# EAGLE design RH024.1 (EAGLE 7.1.0)
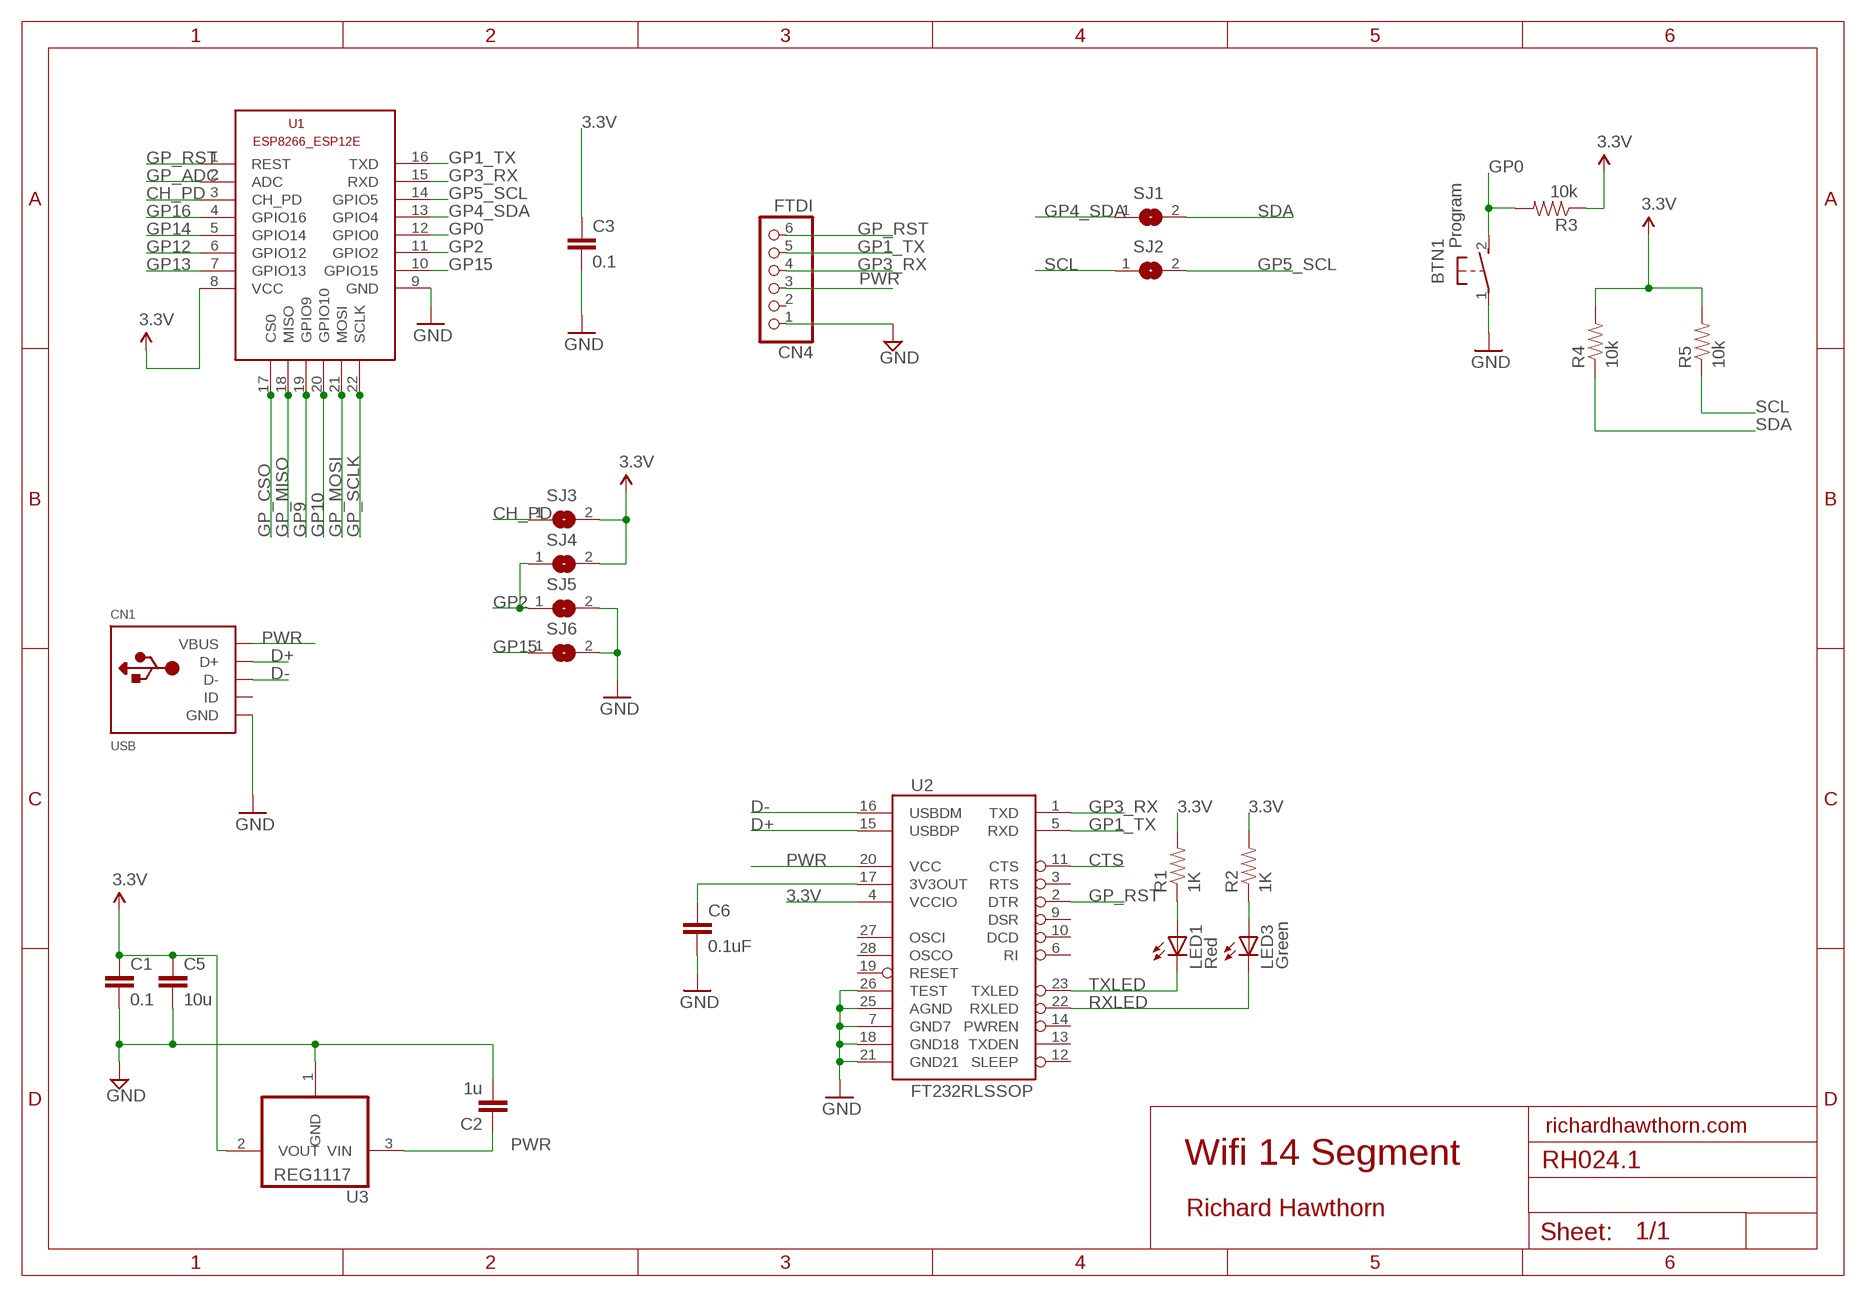
[diagram p0: schematic, sheet 1, part 1 of 2]
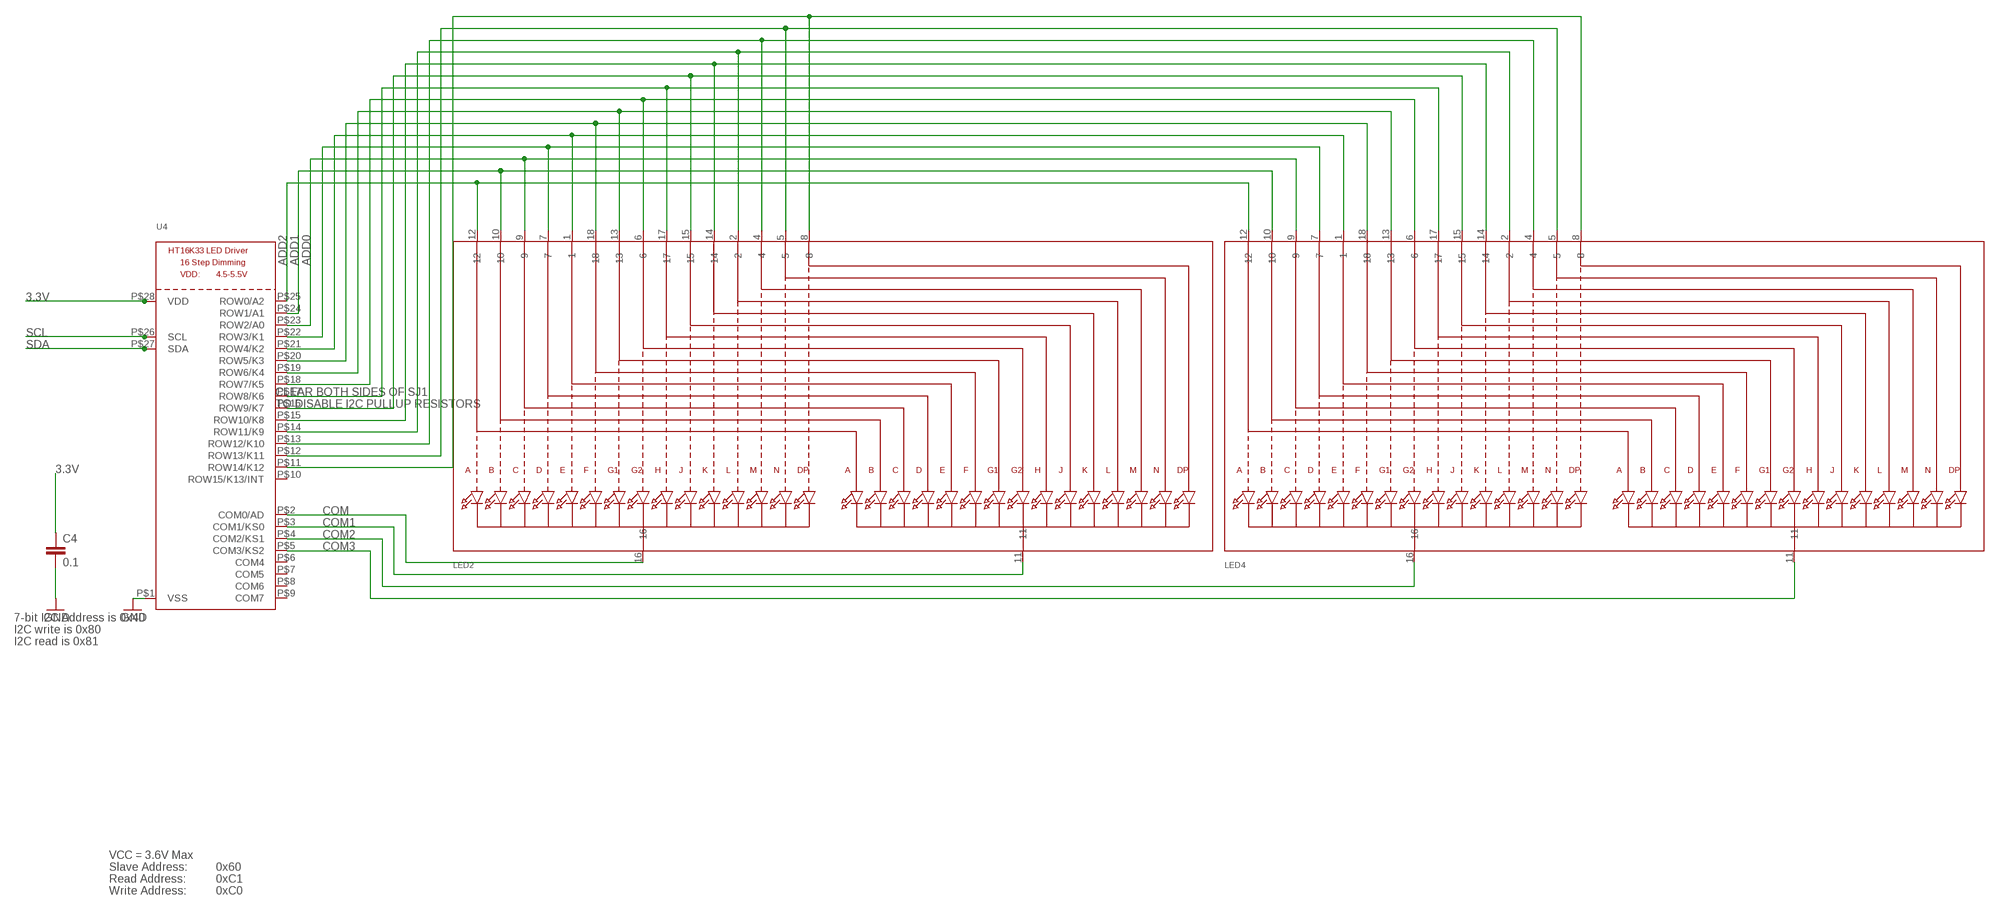
[diagram p1: schematic, sheet 1, part 2 of 2]

## Parts
BTN1  Program  DTS-3  [DTS-3]
C1  0.1  CAP0603-CAP  [0603-CAP]
C2  1u  CAP0603-CAP  [0603-CAP]
C3  0.1  CAP0603-CAP  [0603-CAP]
C4  0.1  CAP0603-CAP  [0603-CAP]
C5  10u  CAP0805-CAP  [0805-CAP]
C6  0.1uF  CAP0402-CAP  [0402-CAP]
CN1  USB  USBMINIB  [USB-MINIB]
CN4  FTDI  PINHD-1X6  [1X06]
LED1  Red  LED0603  [LED-0603]
LED2  DISP_SEGMENT_STARBURST_DUAL_COMMONCATHODE  [SEGMENT_STARTBUST_DUAL_KWA-541CBB]
LED3  Green  LED0603  [LED-0603]
LED4  DISP_SEGMENT_STARBURST_DUAL_COMMONCATHODE  [SEGMENT_STARTBUST_DUAL_KWA-541CBB]
R1  1K  RESISTOR0402-RES  [0402-RES]
R2  1K  RESISTOR0402-RES  [0402-RES]
R3  10k  RESISTOR0805-RES  [0805]
R4  10k  RESISTOR0805-RES  [0805]
R5  10k  RESISTOR0805-RES  [0805]
SJ1  SJ  [SJ]
SJ2  SJ  [SJ]
SJ3  SJ  [SJ]
SJ4  SJ  [SJ]
SJ5  SJ  [SJ]
SJ6  SJ  [SJ]
U1  ESP8266-12EESP8266-ESP12E  [ESP8266-ESP12E]
U2  FT232RLSSOP  [SSOP28DB]
U3  REG1117  [SOT223]
U4  HT16K33_SOP28  [SOP28_300MIL]

## Nets
3.3V: C1.1 C3.1 C4.1 C5.1 R1.2 R2.2 R3.1 R4.2 R5.2 SJ3.2 SJ4.2 U1.8(VCC) U2.4(VCCIO) U3.2(VOUT) U4.P$28(VDD)
3.3VOUT: C6.1 U2.17(3V3OUT)
ADD0: LED2.9 LED4.9 U4.P$23(ROW2/A0)
ADD1: LED2.10 LED4.10 U4.P$24(ROW1/A1)
ADD2: LED2.12 LED4.12 U4.P$25(ROW0/A2)
CH_PD: SJ3.1 U1.3(CH_PD)
COM: LED2.16 U4.P$2(COM0/AD)
COM1: LED2.11 U4.P$3(COM1/KS0)
COM2: LED4.16 U4.P$4(COM2/KS1)
COM3: LED4.11 U4.P$5(COM3/KS2)
CTS: U2.11(CTS)
D+: CN1.D+ U2.15(USBDP)
D-: CN1.D- U2.16(USBDM)
GND [power]: BTN1.1 C1.2 C2.2 C3.2 C4.2 C5.2 C6.2 CN1.GND CN4.1 SJ5.2 SJ6.2 U1.9(GND) U2.7(GND7) U2.18(GND18) U2.21(GND21) U2.25(AGND) U2.26(TEST) U3.1(GND) U4.P$1(VSS)
GP0: BTN1.2 R3.2 U1.12(GPIO0)
GP1_TX: CN4.5 U1.16(TXD) U2.5(RXD)
GP2: SJ4.1 SJ5.1 U1.11(GPIO2)
GP3_RX: CN4.4 U1.15(RXD) U2.1(TXD)
GP4_SDA: SJ1.1 U1.13(GPIO4)
GP5_SCL: SJ2.2 U1.14(GPIO5)
GP9: U1.19(GPIO9)
GP10: U1.20(GPIO10)
GP12: U1.6(GPIO12)
GP13: U1.7(GPIO13)
GP14: U1.5(GPIO14)
GP15: SJ6.1 U1.10(GPIO15)
GP16: U1.4(GPIO16)
GP_ADC: U1.2(ADC)
GP_CSO: U1.17(CS0)
GP_MISO: U1.18(MISO)
GP_MOSI: U1.21(MOSI)
GP_RST: CN4.6 U1.1(REST) U2.2(DTR)
GP_SCLK: U1.22(SCLK)
N$2: LED1.A R1.1
N$3: LED3.A R2.1
N$22: LED2.7 LED4.7 U4.P$22(ROW3/K1)
N$23: LED2.1 LED4.1 U4.P$21(ROW4/K2)
N$24: LED2.18 LED4.18 U4.P$20(ROW5/K3)
N$25: LED2.13 LED4.13 U4.P$19(ROW6/K4)
N$26: LED2.6 LED4.6 U4.P$18(ROW7/K5)
N$29: LED2.17 LED4.17 U4.P$17(ROW8/K6)
N$30: LED2.15 LED4.15 U4.P$16(ROW9/K7)
N$31: LED2.14 LED4.14 U4.P$15(ROW10/K8)
N$32: LED2.2 LED4.2 U4.P$14(ROW11/K9)
N$33: LED2.4 LED4.4 U4.P$13(ROW12/K10)
N$34: LED2.5 LED4.5 U4.P$12(ROW13/K11)
N$35: LED2.8 LED4.8 U4.P$11(ROW14/K12)
PWR [power]: C2.1 CN1.VBUS CN4.3 U2.20(VCC) U3.3(VIN)
RXLED: LED3.C U2.22(RXLED)
SCL: R5.1 SJ2.1 U4.P$26(SCL)
SDA: R4.1 SJ1.2 U4.P$27(SDA)
TXLED: LED1.C U2.23(TXLED)
Unconnected: CN1.ID CN4.2 U2.3(RTS) U2.6(RI) U2.9(DSR) U2.10(DCD) U2.12(SLEEP) U2.13(TXDEN) U2.14(PWREN) U2.19(RESET) U2.27(OSCI) U2.28(OSCO) U4.P$6(COM4) U4.P$7(COM5) U4.P$8(COM6) U4.P$9(COM7) U4.P$10(ROW15/K13/INT)

## Notes on the sheet
- CLEAR BOTH SIDES OF SJ1
- TO DISABLE I2C PULLUP RESISTORS
- 7-bit I2C Address is 0x40
- I2C write is 0x80
- I2C read is 0x81
- richardhawthorn.com
- Wifi 14 Segment
- Richard Hawthorn
- VCC = 3.6V Max
- Slave Address: | 0x60
- Read Address: | 0xC1
- Write Address: | 0xC0

## Library data of the parts
BTN1 = switch-tact:DTS-3
C1-C5 = LowPowerLab:CAP: Capacitor Standard 0603 ceramic capacitor, and 0.1" leaded capacitor.
C6 = SparkFun:CAP: Capacitor Standard 0603 ceramic capacitor, and 0.1" leaded capacitor.
CN1 = LowPowerLab:USB: USB Connectors USBMINIB - Surface Mount Female Mini-B USB Connector 4UConnector: 06564 By microbuilder.eu Thru-hole RA Female Mini-B USB Connector 4UConnector: 18732 By ladyada.net
CN4 = pinhead:PINHD-1X6: PIN HEADER
LED1 LED3 = SparkFun:LED: LEDs Standard schematic elements and footprints for 5mm, 3mm, 1206, and 0603 sized LEDs. 5mm - Spark Fun Electronics SKU : COM-00529 (and others)
LED2 LED4 = microbuilder:DISP_SEGMENT_STARBURST_DUAL_COMMONCATHODE: 2 x Starburst Segment Displays - Common Cathode Luckylight KWA-541CBB
R1-R5 = SparkFun:RESISTOR: Resistor Basic schematic elements and footprints for 0603, 1206, and PTH resistors.
SJ1-SJ6 = jumper:SJ: SMD solder JUMPER
U1 = ESP8266-ESP12E:ESP8266-12E: ESP8266-12E with additional I/O and GPIO04/05 corrected The author cannot warrant that this library is free from error or will meet your specific requirements. Created by PuceBaboon.com. Komagane, Nagano, JAPAN
U2 = SparkFun:FT232RL: USB UART FT232RL 4th Generation USB UART (USB <-> Serial) Controller. Spark Fun Electronics SKU : COM-00650
U3 = burr-brown:REG1117: 800mA and 1A Low Dropout (LDO) Positive Regulator 1.8V, 2.5V, 2.85V, 3.3V, 5V, and Adj; MPN: REG1117; OC_FARNELL: 1097566; OC_NEWARK: 14P6981
U4 = microbuilder:HT16K33_SOP28

## Net classes
1 power: width 0.381 mm, clearance 0.254 mm

## Board
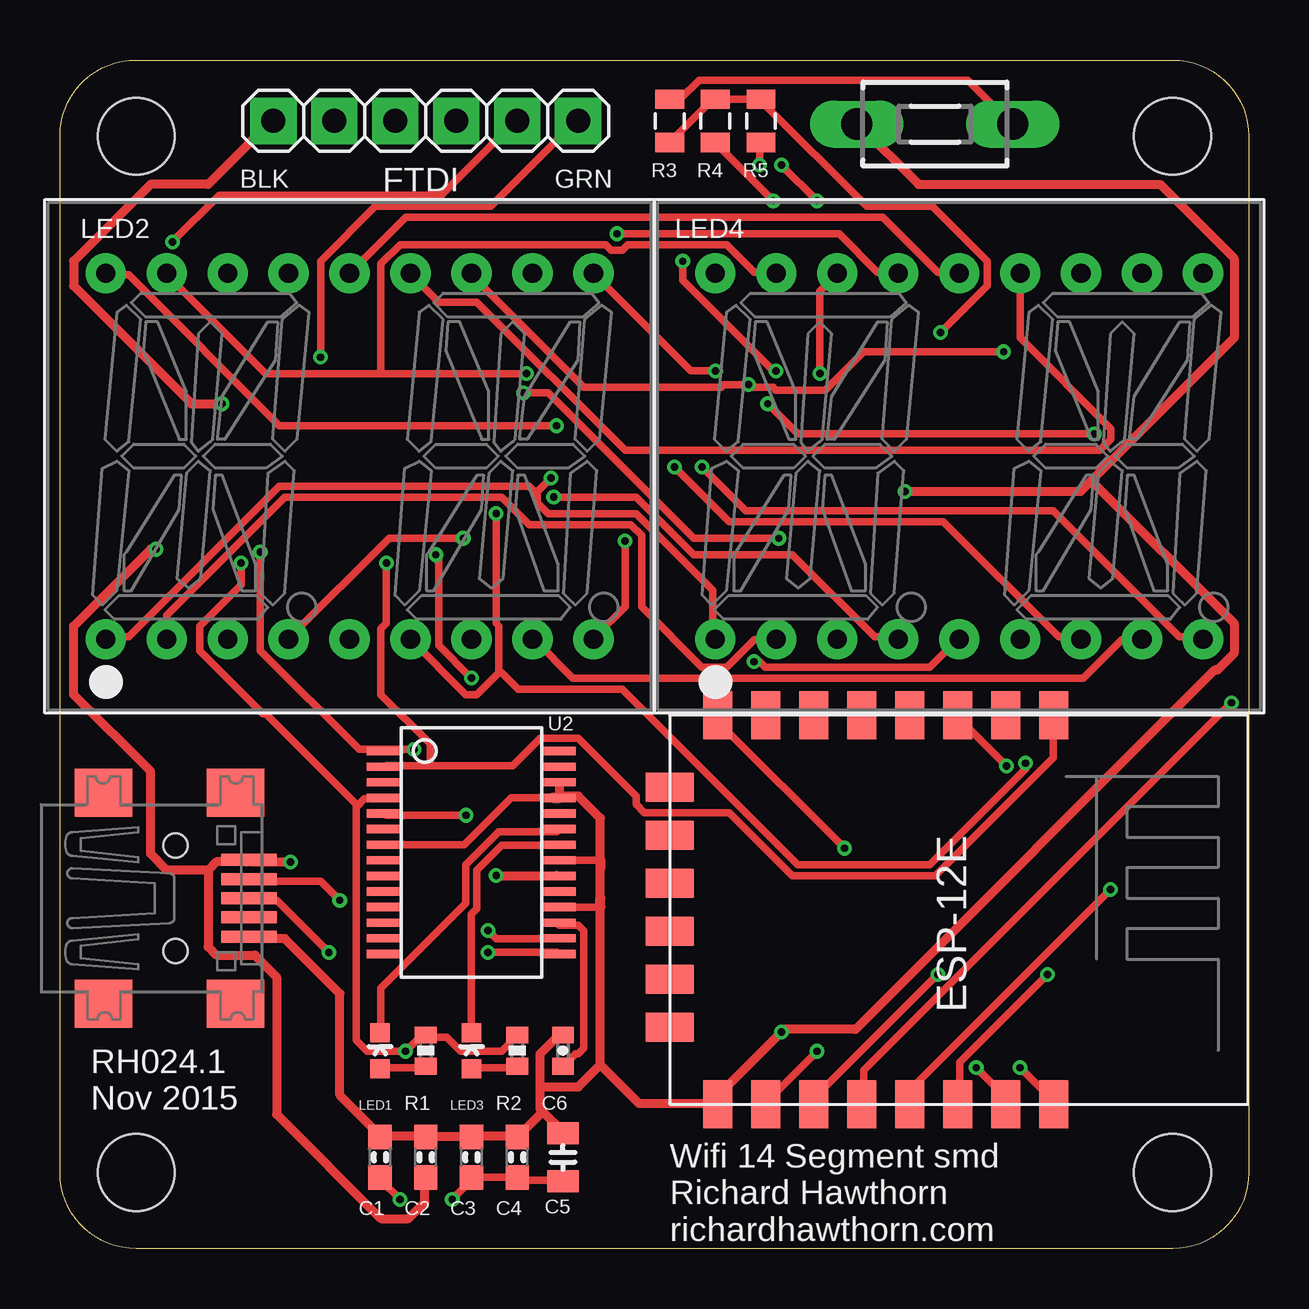
[diagram p2: board, top side]
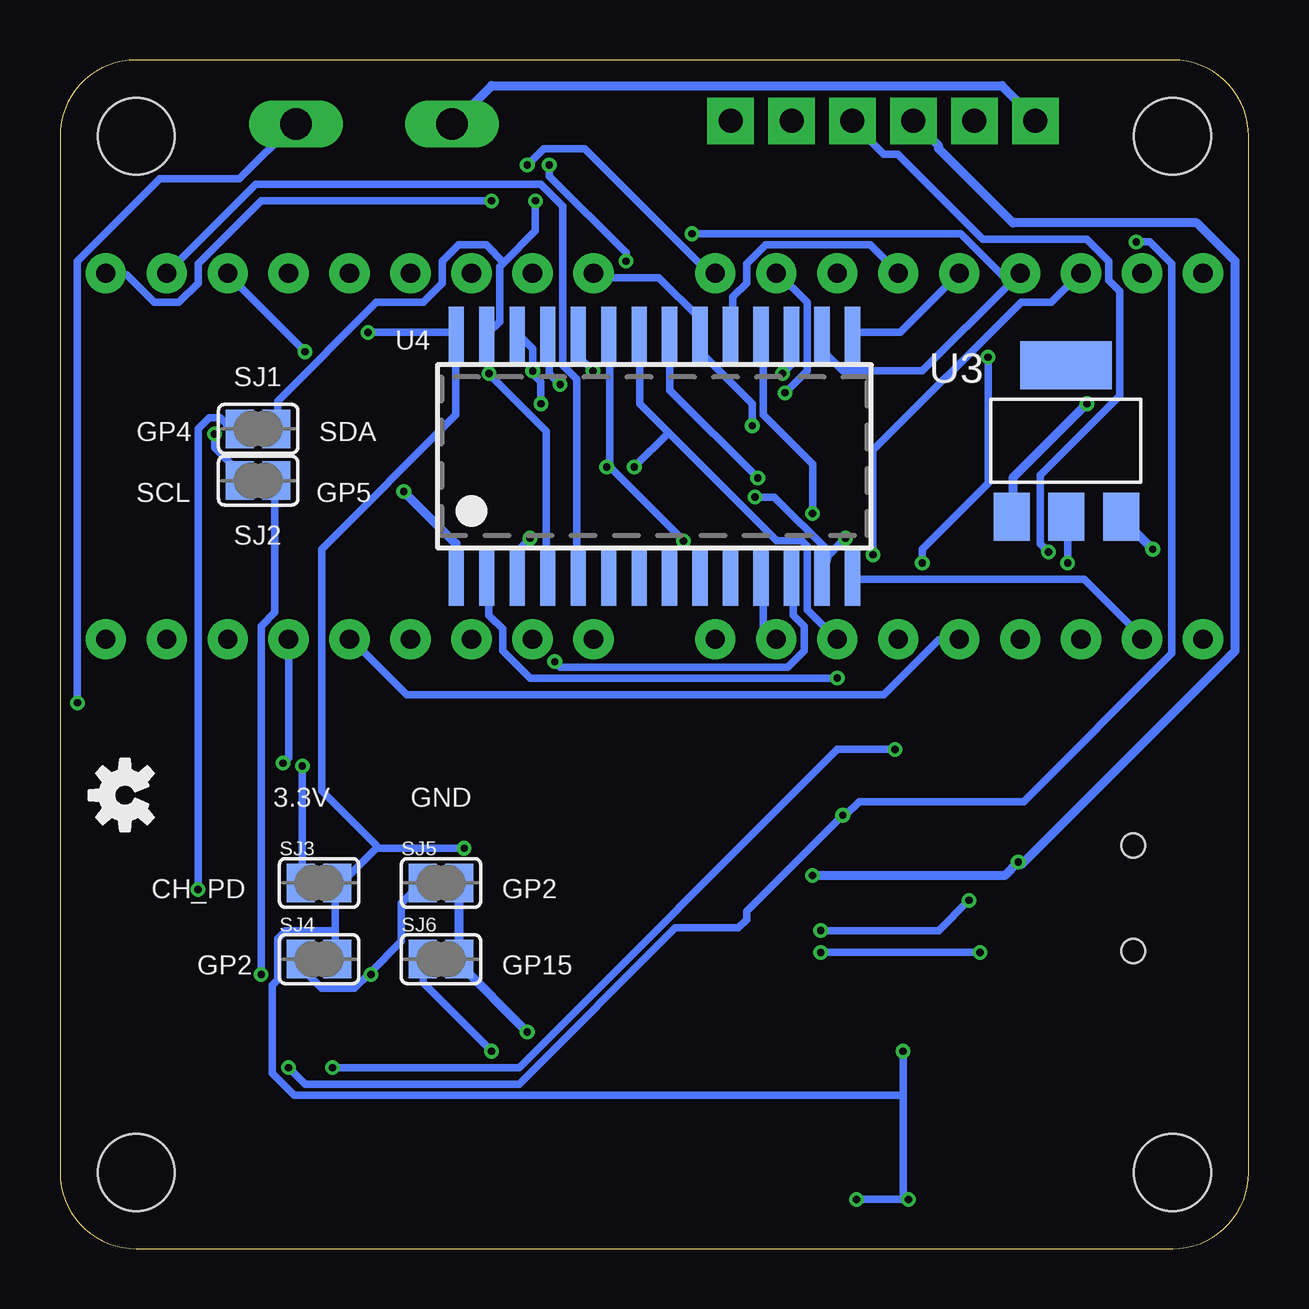
[diagram p3: board, bottom side, seen from below]

Size 49.53 x 49.53 mm. Coordinates in mm from the lower left corner, seen from the top.
Outline: 0,3.17 0,46.35 arc-90 3.17,49.53 46.35,49.53 arc-90 49.53,46.35 49.53,3.17 arc-90 46.35,0 3.17,0 arc-90 0,3.17
Copper layers (1*16): Top 0.035mm / dielectric 1.5mm / Bottom 0.035mm
Design rules "ITEADstudio_DRC *": minimum track width 12mil, minimum drill 12mil, track to track 6mil, track to pad 6mil, pad to pad 6mil, via to via 6mil, smd to smd 0mil, copper to edge 10mil, drill to drill 10mil, minimum pad ring 10mil, minimum via ring 6mil, stop-mask expansion 2mil, vias tented up to drill 100mil, thermal gap 15mil
Holes 3.2 mm at 3.17,3.17 46.35,3.17 3.17,46.35 46.35,46.35
tKeepout: area 0,0 to 5.7,5.7; area 43.8,0 to 49.5,5.7; area 43.8,43.8 to 49.5,49.5; area 0,43.8 to 5.7,49.5
bKeepout: area 0,43.8 to 5.7,49.5; area 43.8,43.8 to 49.5,49.5; area 43.8,0 to 49.5,5.7; area 0,0 to 5.7,5.7
tRestrict: area 24.3,8.9 to 29.1,12.8; area 5.8,16.9 to 6.9,18.5; area 5.2,9.7 to 6.7,10.4
bRestrict: area 27.4,17.7 to 29.2,18.7; area 21.1,13.8 to 22.9,14.9; area 21.6,12.6 to 22.1,13.2; area 20.7,12.6 to 21.2,13.2; area 20.2,12.8 to 20.7,13.5; area 20.1,13.4 to 20.6,14; area 26.5,18.9 to 27.1,19.5; area 26.5,17.9 to 27.1,18.5; area 27.5,19.1 to 28,19.8; area 27.9,18.8 to 29.1,19.6

### Footprints (pad centres in the part's own frame; a part is rotated, then mirrored left to right if it is on the bottom)
DTS-3 = drill 1.3 long: 1 -3.25,0; 2 3.25,0
0603-CAP = smd 1.016 x 0.965: 1 -0.85,0; 2 0.85,0
0805-CAP = smd 0.902 x 1.3: 1 -1,0; 2 1,0
0402-CAP = smd 0.7 x 0.9: 1 -0.65,0; 2 0.65,0
USB-MINIB = smd 0.5 x 2.308: D+ 0,4.064; D- -0.8,4.064; GND 1.6,4.064; ID 0.8,4.064; VBUS -1.6,4.064 | smd 2 x 2.4: GND1 -4.4,-2; GND2 -4.4,3.5; GND3 4.4,3.5; GND4 4.4,-2 | hole 1: -2.2,1; 2.2,1
1X06 = drill 1 pad 1.93 square: 1 -6.35,0; 2 -3.81,0; 3 -1.27,0; 4 1.27,0; 5 3.81,0; 6 6.35,0
LED-0603 = smd 0.8 x 0.8: A 0,-0.75; C 0,0.75
SEGMENT_STARTBUST_DUAL_KWA-541CBB = drill 0.8 pad 1.676: 1 -10.16,-7.62; 2 -7.62,-7.62; 3 -5.08,-7.62; 4 -2.54,-7.62; 5 0,-7.62; 6 2.54,-7.62; 7 5.08,-7.62; 8 7.62,-7.62; 9 10.16,-7.62; 10 10.16,7.62; 11 7.62,7.62; 12 5.08,7.62; 13 2.54,7.62; 14 0,7.62; 15 -2.54,7.62; 16 -5.08,7.62; 17 -7.62,7.62; 18 -10.16,7.62
0402-RES = smd 0.7 x 0.9: 1 -0.65,0; 2 0.65,0
0805 = smd 0.8 x 1.2: 1 -0.9,0; 2 0.9,0
SJ = smd 1.168 x 1.6: 1 -0.762,0; 2 0.762,0
ESP8266-ESP12E = smd 2 x 1.2: 1 0,16; 2 0,14; 3 0,12; 4 0,10; 5 0,8; 6 0,6; 7 0,4; 8 0,2; 9 16.2,2; 10 16.2,4; 11 16.2,6; 12 16.2,8; 13 16.2,10; 14 16.2,12; 15 16.2,14; 16 16.2,16 | smd 1.2 x 2: 17 11,0; 18 3,0; 19 5,0; 20 13,0; 21 7,0; 22 9,0
SSOP28DB = smd 0.348 x 1.397: 1 -4.225,-3.656; 2 -3.575,-3.656; 3 -2.925,-3.656; 4 -2.275,-3.656; 5 -1.625,-3.656; 6 -0.975,-3.656; 7 -0.325,-3.656; 8 0.325,-3.656; 9 0.975,-3.656; 10 1.625,-3.656; 11 2.275,-3.656; 12 2.925,-3.656; 13 3.575,-3.656; 14 4.225,-3.656; 15 4.225,3.656; 16 3.575,3.656; 17 2.925,3.656; 18 2.275,3.656; 19 1.625,3.656; 20 0.975,3.656; 21 0.325,3.656; 22 -0.325,3.656; 23 -0.975,3.656; 24 -1.625,3.656; 25 -2.275,3.656; 26 -2.925,3.656; 27 -3.575,3.656; 28 -4.225,3.656
SOT223 = smd 1.499 x 2.007: 1 -2.261,-3.15; 2 0.025,-3.15; 3 2.311,-3.15 | smd 3.81 x 2.007: 4 0,3.15
SOP28_300MIL = smd 0.635 x 2.286: P$1 -8.255,-5.08; P$2 -6.985,-5.08; P$3 -5.715,-5.08; P$4 -4.445,-5.08; P$5 -3.175,-5.08; P$6 -1.905,-5.08; P$7 -0.635,-5.08; P$8 0.635,-5.08; P$9 1.905,-5.08; P$10 3.175,-5.08; P$11 4.445,-5.08; P$12 5.715,-5.08; P$13 6.985,-5.08; P$14 8.255,-5.08; P$15 8.255,5.08; P$16 6.985,5.08; P$17 5.715,5.08; P$18 4.445,5.08; P$19 3.175,5.08; P$20 1.905,5.08; P$21 0.635,5.08; P$22 -0.635,5.08; P$23 -1.905,5.08; P$24 -3.175,5.08; P$25 -4.445,5.08; P$26 -5.715,5.08; P$27 -6.985,5.08; P$28 -8.255,5.08

### Placement (x,y rotation side)
BTN1  36.45,46.86 0 top
C1  13.34,3.81 90 top
C2  15.24,3.81 90 top
C3  17.14,3.81 90 top
C4  19.05,3.81 90 top
C5  20.95,3.81 90 top
C6  20.95,8.26 90 top
CN1  3.81,14.61 270 top
CN4  15.24,46.99 0 top
LED1  13.34,8.26 0 top
LED2  12.06,33.02 0 top
LED3  17.14,8.26 0 top
LED4  37.47,33.02 0 top
R1  15.24,8.26 90 top
R2  19.05,8.26 90 top
R3  25.4,46.99 90 top
R4  27.3,46.99 90 top
R5  29.21,46.99 90 top
SJ1  41.27,34.16 0 bottom
SJ2  41.27,32 0 bottom
SJ3  38.73,15.24 0 bottom
SJ4  38.73,12.06 0 bottom
SJ5  33.66,15.24 0 bottom
SJ6  33.66,12.06 0 bottom
U1  25.4,22.23 270 top
U2  17.14,16.51 270 top
U3  7.62,33.66 0 bottom
U4  24.77,33.02 0 bottom
U$3  [OSHW-LOGO-S]  46.82,18.9 90 bottom

### Tracks (layer width: path | path; a pad name or v marks a point on that pad's centre or on a via)
3.3V  (via drill 0.3)
  Top 0.305: v14.17,2.06 13.37,2.86 C1.1 | v16.34,2.06 17.14,2.86 C3.1 17.26,2.97 18.97,2.97 C4.1 19.09,2.86 20.92,2.86 C5.1 | R2.2 18.97,8.8 18.4,8.23 16.69,8.23 16.12,8.8 15.32,8.8 R1.2 15.09,8.91 v14.4,8.23 12.8,8.23 12.34,8.69 12.34,18.4 12.4,18.46 | 12.4,18.46 12.69,18.75 13.49,18.75 U2.4 | v7.54,28.57 7.54,27.66 5.83,25.95 5.83,24.92 8.46,22.29 8.57,22.29 12.4,18.46 | R3.1 25.49,46.18 27.2,47.89 R4.2 27.43,47.89 29.15,47.89 R5.2 29.26,47.78 33.6,43.43 36.35,43.43 38.63,41.15 38.63,40.12 v36.69,38.18 | v32.69,16.69 27.43,21.95 27.43,22.17 U1.8
  Bottom 0.305: v16.34,2.06 v14.17,2.06 14.4,2.17 14.4,6.4 | v7.54,28.57 7.54,30.4 U3.2 | v14.4,8.23 14.4,6.4 | 38.06,13.26 38.06,15.2 SJ3.2 37.83,15.2 36.35,16.69 | 38.06,13.26 38.06,12.12 SJ4.2 | 36.35,16.69 v32.69,16.69 | 36.35,16.69 36.35,16.8 38.63,19.09 38.63,29.15 33.03,34.75 33.03,38.06 U4.P$28 33.15,38.18 v36.69,38.18 | 14.4,6.4 39.78,6.4 40.69,7.32 40.69,10.97 40.46,11.2 40.46,12.92 40.12,13.26 38.06,13.26
3.3VOUT
  Top 0.305: C6.1 21.03,7.66 21.49,8.12 21.6,8.12 21.83,8.34 21.83,13.26 21.6,13.49 20.8,13.49 U2.17
ADD0  (via drill 0.3)
  Top 0.305: v23.55,29.49 23.55,26.75 22.29,25.49 LED2.9 | v26.75,32.58 28.57,30.75 41.38,30.75 46.63,25.49 47.55,25.49 LED4.9
  Bottom 0.305: 26.63,32.58 26.63,38.06 U4.P$23 | v23.55,29.49 26.63,32.58 | v26.75,32.58 26.63,32.58
ADD1  (via drill 0.3)
  Top 0.305: v27.32,36.58 26.29,36.58 LED2.10 | v30.06,45.15 v31.55,43.66
  Bottom 0.305: v27.32,36.58 27.89,37.15 27.89,38.06 U4.P$24 | v31.55,43.66 41.15,43.66 43.78,41.03 43.78,40.23 44.58,39.43 45.61,39.43 46.75,40.58 47.55,40.58 LED4.10 | v30.06,45.15 29.38,45.83 27.66,45.83 22.52,40.69 22.29,40.69 LED2.10
ADD2  (via drill 0.3)
  Top 0.305: LED2.12 17.14,40.58 21.83,35.89 27.55,35.89 27.66,36.01 v28.69,36.01 28.69,35.89 29.72,35.89 29.83,35.78 31.89,35.78 33.49,37.38 v39.32,37.38
  Bottom 0.305: v28.69,36.01 29.15,36.46 29.15,38.06 U4.P$25 | v39.32,37.38 42.52,40.58 LED4.12
CH_PD  (via drill 0.3)
  Top 0.305: v39.43,20.12 37.38,22.17 U1.3
  Bottom 0.305: v39.43,20.12 39.43,15.32 SJ3.1
COM  (via drill 0.3)
  Top 0.305: v17.14,23.77 15.77,25.15 15.77,28.8 v15.66,28.92
  Bottom 0.305: v17.14,23.77 29.95,23.77 31.09,24.92 31.09,25.83 31.66,26.4 31.66,27.89 U4.P$2 | v15.66,28.92 15.66,33.26 9.49,39.43 8.23,39.43 7.09,40.58 LED2.16
COM1  (via drill 0.3)
  Top 0.305: v29.95,29.6 26.4,29.6 20.34,35.66 v19.32,35.66
  Bottom 0.305: v29.95,29.6 30.4,29.15 30.4,28 U4.P$3 | v19.32,35.66 18.4,36.58 18.4,39.43 19.66,40.69 LED2.11
COM2  (via drill 0.3)
  Top 0.305: v31.66,36.46 31.66,39.89 32.35,40.58 LED4.16
  Bottom 0.305: v31.66,36.46 29.26,34.06 29.26,28 U4.P$4
COM3
  Bottom 0.305: LED4.11 41.38,44.35 29.49,44.35 28.57,43.43 28.57,36.8 28,36.23 28,28 U4.P$5
D+  (via drill 0.3)
  Top 0.305: v17.83,12.34 20.69,12.34 U2.15 | v11.2,12.34 9.03,14.52 7.89,14.52 CN1.D+
  Bottom 0.305: v11.2,12.34 v17.83,12.34
D-  (via drill 0.3)
  Top 0.305: v17.83,13.26 18.17,12.92 20.69,12.92 U2.16 | v11.66,14.52 10.86,15.32 7.89,15.32 CN1.D-
  Bottom 0.305: v17.83,13.26 12.92,13.26 v11.66,14.52
GND  (via drill 0.3)
  Top 0.305: U2.18 22.52,14.23 | U2.21 22.52,16.18 | U2.7 16.84,16.84 18.8,18.8 20.54,18.8
  Top 0.381: U2.26 20.8,18.86 U2.25 20.92,18.86 21.6,18.86 22.52,17.95 22.52,15.88 22.52,14.61 22.52,7.66 | 20,6.74 20,5.83 20.12,5.71 | 20,6.74 20,8.12 20.69,8.8 20.92,8.8 C6.2 | 20.12,5.71 20.92,4.92 C5.2 | 20.12,5.71 19.09,4.69 C4.2 18.97,4.69 17.26,4.69 C3.2 17.14,4.69 15.32,4.69 C2.2 15.2,4.69 13.37,4.69 C1.2 13.26,4.8 11.66,6.4 11.66,10.63 9.37,12.92 7.89,12.92 CN1.GND | 22.52,7.66 21.6,6.74 20,6.74 | 22.52,7.66 24.12,6.06 27.32,6.06 U1.9 27.2,6.17 v30.06,9.03 30.18,9.14 33.15,9.14 48.12,24.12 48.23,24.12 48.92,24.8 48.92,26.06 42.98,32 | v6.74,35.2 5.49,35.2 0.57,40.12 0.57,41.15 3.77,44.35 6.17,44.35 8.8,46.98 CN4.1 | v35.2,31.55 42.52,31.55 42.98,32 | 42.98,32 48.92,37.95 48.92,41.26 45.83,44.35 35.78,44.35 33.26,46.86 BTN1.1
  Top 0.406: 22.52,14.23 22.52,14.61 | 22.52,16.18 22.52,15.88 | 20.54,18.8 U2.25
  Bottom 0.381: SJ5.2 32.92,15.2 32.92,12.12 SJ6.2 32.92,11.89 v30.06,9.03 | v6.74,35.2 9.83,32.12 9.83,30.52 U3.1 | v35.2,31.55 33.03,29.38 33.03,28 U4.P$1 | CN4.1 8.91,47.09 10.29,48.46 31.55,48.46 33.15,46.86 BTN1.1
GP0  (via drill 0.3)
  Top 0.305: R3.2 25.49,47.89 25.83,47.89 26.63,48.69 37.83,48.69 39.66,46.86 BTN1.2 | v48.81,22.75 33.49,7.43 33.49,6.06 U1.12
  Bottom 0.305: v48.81,22.75 48.81,41.15 45.38,44.58 42.06,44.58 39.78,46.86 BTN1.2
GP1_TX  (via drill 0.3)
  Top 0.305: v16.92,18.06 13.6,18.06 U2.5 | v40.01,7.54 41.49,6.06 U1.16 | v4.69,41.95 6.63,43.89 15.89,43.89 18.97,46.98 CN4.5
  Bottom 0.305: v40.01,7.54 39.32,6.86 30.4,6.86 23.89,13.37 21.26,13.37 20.92,13.72 20.92,14.06 v16.92,18.06 16.8,18.06 16.23,18.63 9.37,18.63 3.2,24.8 3.2,41.03 4.12,41.95 v4.69,41.95
GP2  (via drill 0.3)
  Top 0.305: v36.58,11.43 31.43,6.29 31.43,6.06 U1.11
  Bottom 0.305: 36.63,11.49 35.32,12.8 35.32,14.4 34.52,15.2 SJ5.1 | 36.63,11.49 37.26,10.86 38.63,10.86 39.43,11.66 39.43,12 SJ4.1 | v36.58,11.43 36.63,11.49
GP3_RX  (via drill 0.3)
  Top 0.305: v8.34,29.03 8.34,24.92 12.46,20.8 13.49,20.8 U2.1 13.6,20.8 v14.74,20.8 | v38.18,7.54 39.32,6.4 39.32,6.06 U1.15
  Bottom 0.305: v8.34,29.03 8.69,29.38 8.69,32.23 5.37,35.55 5.37,39.89 5.83,40.35 5.83,41.15 6.74,42.06 11.09,42.06 14.63,45.61 15.2,45.61 16.57,46.98 CN4.4 | v38.18,7.54 30.4,7.54 17.14,20.8 v14.74,20.8
GP4_SDA  (via drill 0.3)
  Top 0.305: v43.78,14.97 35.43,6.63 35.43,6.06 U1.13
  Bottom 0.305: v43.78,14.97 43.78,34.18 43.32,34.63 42.86,34.63 42.41,34.18 42.06,34.18 SJ1.1
GP5_SCL  (via drill 0.3)
  Top 0.305: v41.15,11.43 37.49,7.77 37.49,6.06 U1.14
  Bottom 0.305: v41.15,11.43 41.15,25.95 40.58,26.52 40.58,32 SJ2.2
GP15  (via drill 0.3)
  Top 0.305: v31.55,8.23 29.38,6.06 U1.10
  Bottom 0.305: v31.55,8.23 34.4,11.09 34.4,12 SJ6.1
GP_RST  (via drill 0.3)
  Top 0.305: 15.43,20.12 18.86,20.12 20,21.26 21.6,21.26 24,18.86 24,18.52 24.35,18.17 27.89,18.17 30.52,15.54 36.46,15.54 41.38,20.46 41.38,22.17 U1.1 | 15.43,20.12 13.6,20.12 U2.2 | v10.86,37.15 10.86,41.15 13.14,43.43 17.95,43.43 21.49,46.98 CN4.6 | v13.6,28.57 13.6,26.06 13.37,25.83 13.37,23.09 15.43,21.03 15.43,20.12
  Bottom 0.305: v10.86,37.15 10.86,31.89 13.6,29.15 v13.6,28.57
N$2
  Top 0.305: LED1.A 13.37,7.54 15.2,7.54 R1.1
N$3
  Top 0.305: LED3.A 17.14,7.54 18.97,7.54 R2.1
N$22  (via drill 0.3)
  Top 0.305: v25.6,32.58 27.89,30.29 36.8,30.29 41.6,25.49 42.52,25.49 LED4.7
  Bottom 0.305: 24.17,34 19.66,29.49 18.63,29.49 18.4,29.26 18.4,26.63 17.14,25.38 LED2.7 | 24.17,34 25.38,35.2 25.38,38.06 U4.P$22 | 24.17,34 v25.6,32.58
N$23  (via drill 0.3)
  Top 0.305: 19.89,31.55 v20.46,32.12 | 19.89,31.55 19.89,31.09 20.34,30.63 24,30.63 27.2,27.43 27.2,25.49 LED4.1 | LED2.1 1.94,25.49 2.86,25.49 9.14,31.77 19.55,31.77 19.77,31.55 19.89,31.55
  Bottom 0.305: v20.46,32.12 24.12,35.78 24.12,38.06 U4.P$21
N$24  (via drill 0.3)
  Top 0.305: v20.69,34.29 9.14,34.29 2.86,40.58 1.94,40.58 LED2.18
  Bottom 0.305: LED4.18 27.2,40.58 27.09,40.46 24.57,40.46 22.86,38.75 U4.P$20 22.75,38.06 22.75,37.26 20.69,35.2 v20.69,34.29
N$25
  Top 0.305: LED4.13 40.01,37.95 43.78,34.18 43.78,33.72 43.32,33.26 23.55,33.26 17.37,39.43 15.77,39.43 14.63,40.58 LED2.13
  Bottom 0.305: U4.P$19 21.49,38.18 21.49,39.66 20.92,40.23 20.92,41.03 20.12,41.83 15.77,41.83 14.63,40.69 LED2.13
N$26  (via drill 0.3)
  Top 0.305: v18.17,30.63 18.17,26.06 18.29,25.95 18.29,24 | 18.29,24 17.37,23.09 16.92,23.09 LED2.6 | v40.23,20.23 40.23,20 36.23,16 30.75,16 23.43,23.32 19.09,23.32 18.4,24 18.29,24
  Bottom 0.305: v18.17,30.63 18.17,32.69 20.23,34.75 20.23,38.06 U4.P$18 | LED4.6 40.01,20.46 v40.23,20.23
N$29  (via drill 0.3)
  Top 0.305: 13.37,36.46 8.57,36.46 4.46,40.58 LED2.17 | 13.37,36.46 v19.43,36.46 | 13.37,36.46 13.37,41.03 14.17,41.83 22.75,41.83 22.97,41.6 23.43,41.6 23.66,41.83 27.77,41.83 28.92,40.69 29.83,40.69 LED4.17
  Bottom 0.305: v19.43,36.46 19.09,36.8 19.09,38.06 U4.P$17
N$30  (via drill 0.3)
  Top 0.305: v23.2,42.29 32.46,42.29 34.06,40.69 34.86,40.69 LED4.15
  Bottom 0.305: 9.94,40.23 9.6,40.58 LED2.15 9.94,40.23 | 9.94,40.23 13.6,36.58 16.92,36.58 17.72,37.38 17.72,38.06 U4.P$16 | v23.2,42.29 12,42.29 9.94,40.23
N$31
  Top 0.305: LED2.14 14.4,42.98 34.29,42.98 36.58,40.69 37.38,40.69 LED4.14
  Bottom 0.305: U4.P$15 16.46,38.18 14.52,38.18 12.12,40.58 LED2.14
N$32
  Top 0.305: LED4.2 29.83,25.38 28.92,25.38 27.77,24.23 26.75,24.23 24.23,26.75 24.23,29.72 23.77,30.18 19.55,30.18 18.4,31.32 9.37,31.32 4.46,26.4 4.46,25.49 LED2.2
  Bottom 0.305: U4.P$14 16.46,27.89 6.86,27.89 4.46,25.49 LED2.2
N$33  (via drill 0.3)
  Top 0.305: v16.8,29.6 13.72,29.6 9.6,25.49 LED2.4 | v20.57,31.32 24,31.32 26.4,28.92 30.52,28.92 33.95,25.49 34.86,25.49 LED4.4
  Bottom 0.305: v16.8,29.6 17.72,28.69 17.72,28 U4.P$13 17.49,29.03 19.77,31.32 v20.57,31.32
N$34  (via drill 0.3)
  Top 0.305: v28.92,24.46 29.15,24.46 29.38,24.23 36.23,24.23 37.38,25.38 LED4.5
  Bottom 0.305: v28.92,24.46 28.69,24.23 19.2,24.23 18.52,24.92 18.52,25.95 18.97,26.4 18.97,27.89 U4.P$12 | LED2.5 12.12,25.38 12.92,25.38 15.2,23.09 35.09,23.09 37.38,25.38 LED4.5
N$35
  Top 0.305: LED4.8 45.03,25.38 44.23,25.38 42.63,23.77 21.37,23.77 19.77,25.38 LED2.8
  Bottom 0.305: LED2.8 20.23,25.95 20.23,27.89 U4.P$11
PWR  (via drill 0.3)
  Top 0.381: 6.17,15.77 6.17,12.57 6.51,12.23 8.12,12.23 9.03,11.32 9.03,5.6 13.37,1.26 14.52,1.26 15.2,1.94 15.2,2.86 C2.1 | 6.17,15.77 6.51,16.12 7.77,16.12 CN1.VBUS 8,16.12 v9.6,16.12 | v18.17,15.54 20.69,15.54 U2.20 | v4,29.15 3.77,29.15 0.57,25.95 0.57,23.09 3.77,19.89 3.77,16.46 4.46,15.77 6.17,15.77
  Bottom 0.381: v18.17,15.54 10.17,15.54 v9.6,16.12 9.49,16 0.57,24.92 0.57,41.15 2.17,42.75 9.83,42.75 12.92,45.83 12.92,45.95 13.95,46.98 CN4.3 | v4,29.15 5.26,30.4 U3.3
RXLED
  Top 0.305: LED3.C 17.14,13.95 17.37,14.17 17.37,15.77 18.4,16.8 20.69,16.8 U2.22
SCL  (via drill 0.3)
  Top 0.305: v29.15,45.15 29.15,46.06 R5.1 | v25.95,41.15 25.95,40.35 29.72,36.58 v29.83,36.58 | v43.09,33.95 30.75,33.95 v29.49,35.2
  Bottom 0.305: v29.15,45.15 29.15,44.69 25.95,41.49 v25.95,41.15 | U4.P$26 30.4,38.06 29.83,37.49 v29.83,36.58 29.83,36.46 29.49,36.12 v29.49,35.2 | v43.09,33.95 43.09,33.38 42.06,32.35 42.06,32 SJ2.1
SDA  (via drill 0.3)
  Top 0.305: v29.72,43.66 27.32,46.06 R4.1
  Bottom 0.305: v29.72,43.66 29.72,42.41 31.03,41.09 | 31.03,41.09 31.2,40.92 31.2,38.63 31.66,38.18 U4.P$27 | 31.03,41.09 31.77,41.83 32.92,41.83 33.6,41.15 33.6,40.23 34.4,39.43 36.35,39.43 40.46,35.32 40.46,34.18 SJ1.2
TXLED
  Top 0.305: LED1.C 13.37,9.03 13.37,10.86 16.92,14.4 16.92,16 18.29,17.37 20.69,17.37 U2.23

### Text on the board
tNames: FTDI | BLK | GRN | RH024.1 / Nov 2015 | Wifi 14 Segment smd / Richard Hawthorn / richardhawthorn.com
bNames: SDA | GP4 | GP5 | SCL | GND | 3.3V | GP2 | CH_PD | GP15 | GP2
tDocu: REG